# Altium project Business_Card.PrjPcb
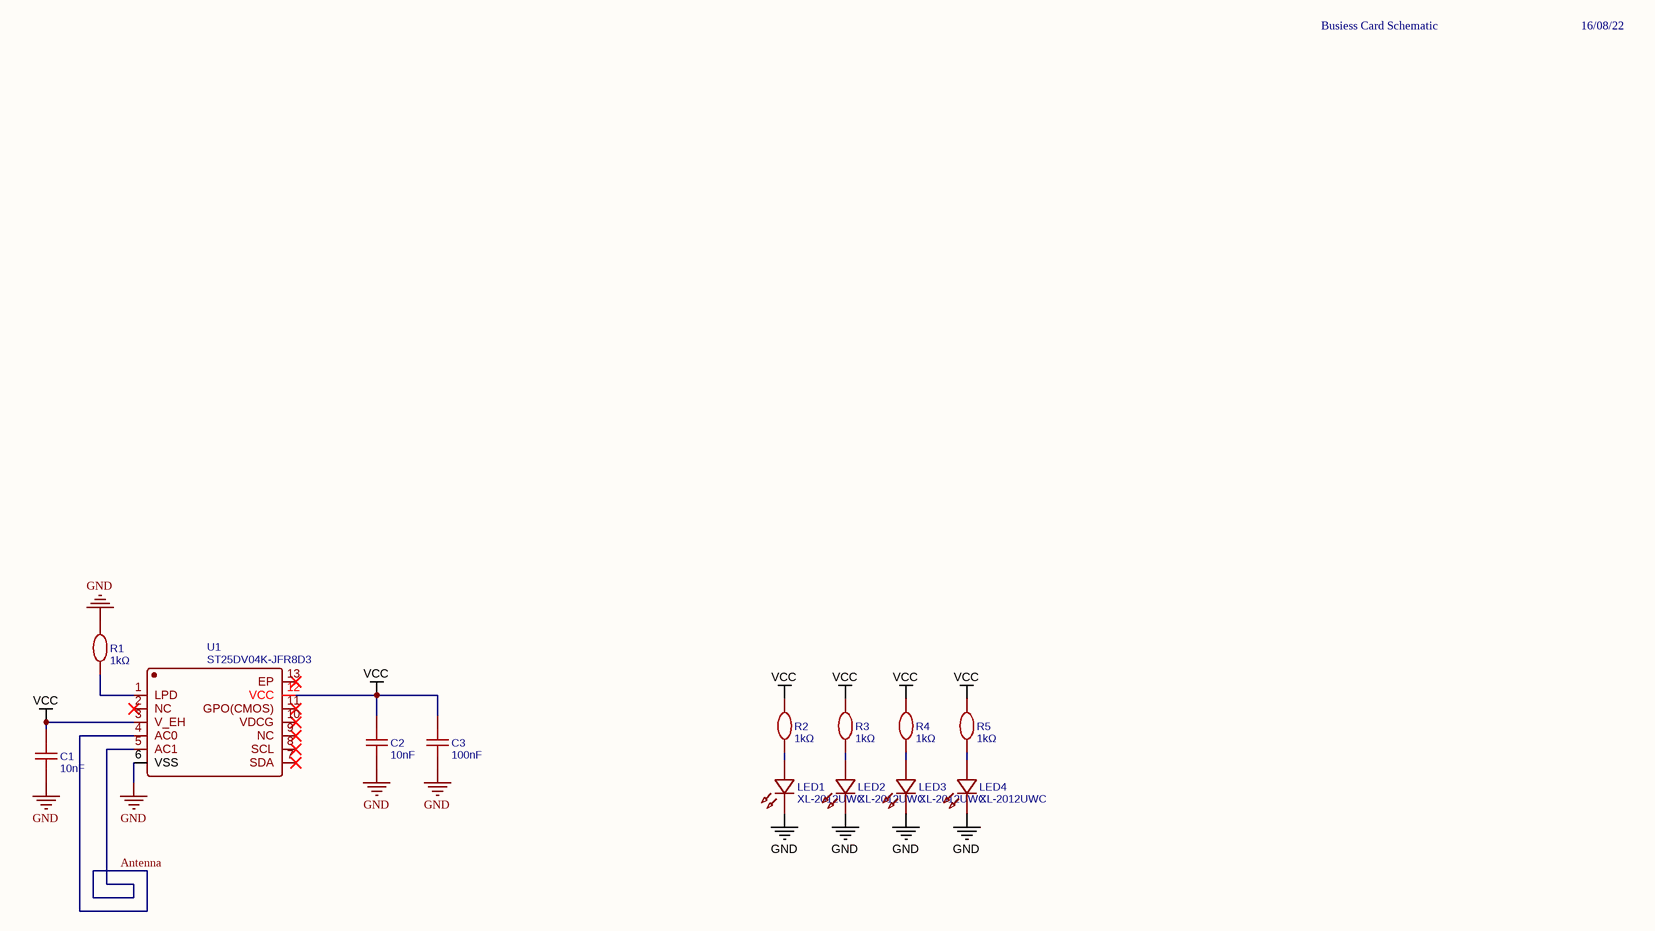
[diagram p0: B_Card.SchDoc]
1 sheet, 13 parts. Net scope: global (net labels, ports and power ports of the same name join across sheets).
Board file: B_Card.PcbDoc

## Sheet B_Card.SchDoc: Business Card
size 420 x 297 mm; Date: 16/08/2022; Author: Francesco Mariotti; DrawnBy: Francesco Mariotti; Engineer: Francesco Mariotti; DocumentNumber: 1; Revision: 1; SheetNumber: 1; SheetTotal: 1; DocumentName: Senza Titolo; ProjectName: Senza Titolo

### Parts
C1  10nF  [C0603]
C2  10nF  [C0603]
C3  100nF  [C0603]
LED1  XL-2012UWC  [LED0805-RD_WHITE]
LED2  XL-2012UWC  [LED0805-RD_WHITE]
LED3  XL-2012UWC  [LED0805-RD_WHITE]
LED4  XL-2012UWC  [LED0805-RD_WHITE]
R1  1kΩ  [R0603]
R2  1kΩ  [R0603]
R3  1kΩ  [R0603]
R4  1kΩ  [R0603]
R5  1kΩ  [R0603]
U1  ST25DV04K-JFR8D3  [UDFN-12_L3.0-W3.0-P0.50-BL-EP]

### Nets
GND: C1.1 C2.2 C3.1 LED1.1(K) LED2.1(K) LED3.1(K) LED4.1(K) R1.2 U1.6(VSS)
VCC: C1.2 C2.1 C3.2 R2.2 R3.2 R4.2 R5.2 U1.3(V_EH) U1.12(VCC)
Antenna: U1.4(AC0) U1.5(AC1)
NetLED1_2: LED1.2(A) R2.1
NetLED2_2: LED2.2(A) R3.1
NetLED3_2: LED3.2(A) R4.1
NetLED4_2: LED4.2(A) R5.1
NetR1_1: R1.1 U1.1(LPD)

Not connected (* = marked no-connect by the designer): U1 2(NC)* 7(SDA)* 8(SCL)* 9(NC)* 10(VDCG)* 11(GPO(CMOS))* 13(EP)*

### Notes on the sheet
- Busiess Card Schematic
- 16/08/22
- THIS DOCUMENT AND THE DATA DISCLOSED HEREIN OR
- HEREWITH IS THE PROPERTY OF ALTIUM LIMITED AND MAY
- DWG NO:
- REVISION
- REV:
- DESCRIPTION
- DATE
- APPROVED
- BE FREELY DISTRIBUTED IN WHOLE. NO RIGHTS ARE
- RESERVED OR EXPRESS OR IMPLIED WARANTEE GIVEN.
- ENG:
- APPROVALS
- PROJECT
- DSN:
- CHK:
- REFERENCE DOCUMENTS
- PROJECT REVISION:
- TITLE
- DOCUMENT REVISION:
- DESIGN ITEM:
- BOM:
- FAB DWG:
- PCB DWG:
- ASSY DWG:
- SCALE:
- A3
- SIZE
- CAGE CODE
- FILE NAME
- DWG NO.
- SHEET
- OF
- REV

### Library data of the parts
C1 C2 = 10nF: BOM_Manufacturer: MuRata; BOM_Manufacturer Part: GRM1885C1H103JA01D; nameAlias: Capacitance; BOM_Supplier: LCSC; BOM_Supplier Part: C85973; BOM_JLCPCB Part Class: Extended Part; spicePre: C; spiceSymbolName: GRM1885C1H103JA01D
C3 = 100nF: BOM_Manufacturer: MuRata; BOM_Manufacturer Part: GRM188R71E104KA01D; nameAlias: Capacitance; BOM_Supplier: LCSC; BOM_Supplier Part: C77050; BOM_JLCPCB Part Class: Extended Part; spicePre: C; spiceSymbolName: GRM188R71E104KA01D
LED1-LED4 = XL-2012UWC: BOM_Manufacturer: XINGLIGHT(成兴光); Contributor: LCSC; BOM_Supplier: LCSC; BOM_Supplier Part: C965818; BOM_Manufacturer Part: XL-2012UWC; link: https://atta.szlcsc.com/upload/public/pdf/source/20210104/C965818_E2ACBECB690C5CE73E796771E7D6A378.pdf; BOM_JLCPCB Part Class: Extended Part; spicePre: L; spiceSymbolName: XL-2012UWC
R1-R5 = 1kΩ: BOM_Manufacturer: FOJAN(富捷); BOM_Manufacturer Part: FRC0603J102 TS; nameAlias: Resistance; Contributor: lcsc; BOM_Supplier: LCSC; BOM_Supplier Part: C2907113; BOM_JLCPCB Part Class: Extended Part; spicePre: R; spiceSymbolName: FRC0603J102 TS
U1 = ST25DV04K-JFR8D3: BOM_Manufacturer: ST(意法半导体); Contributor: LCSC; BOM_Supplier: LCSC; BOM_Supplier Part: C2654867; BOM_Manufacturer Part: ST25DV04K-JFR8D3; BOM_JLCPCB Part Class: Extended Part; spicePre: U; spiceSymbolName: ST25DV04K-JFR8D3